# EAGLE schematic SchemaEletrica (EAGLE 9.6.2)
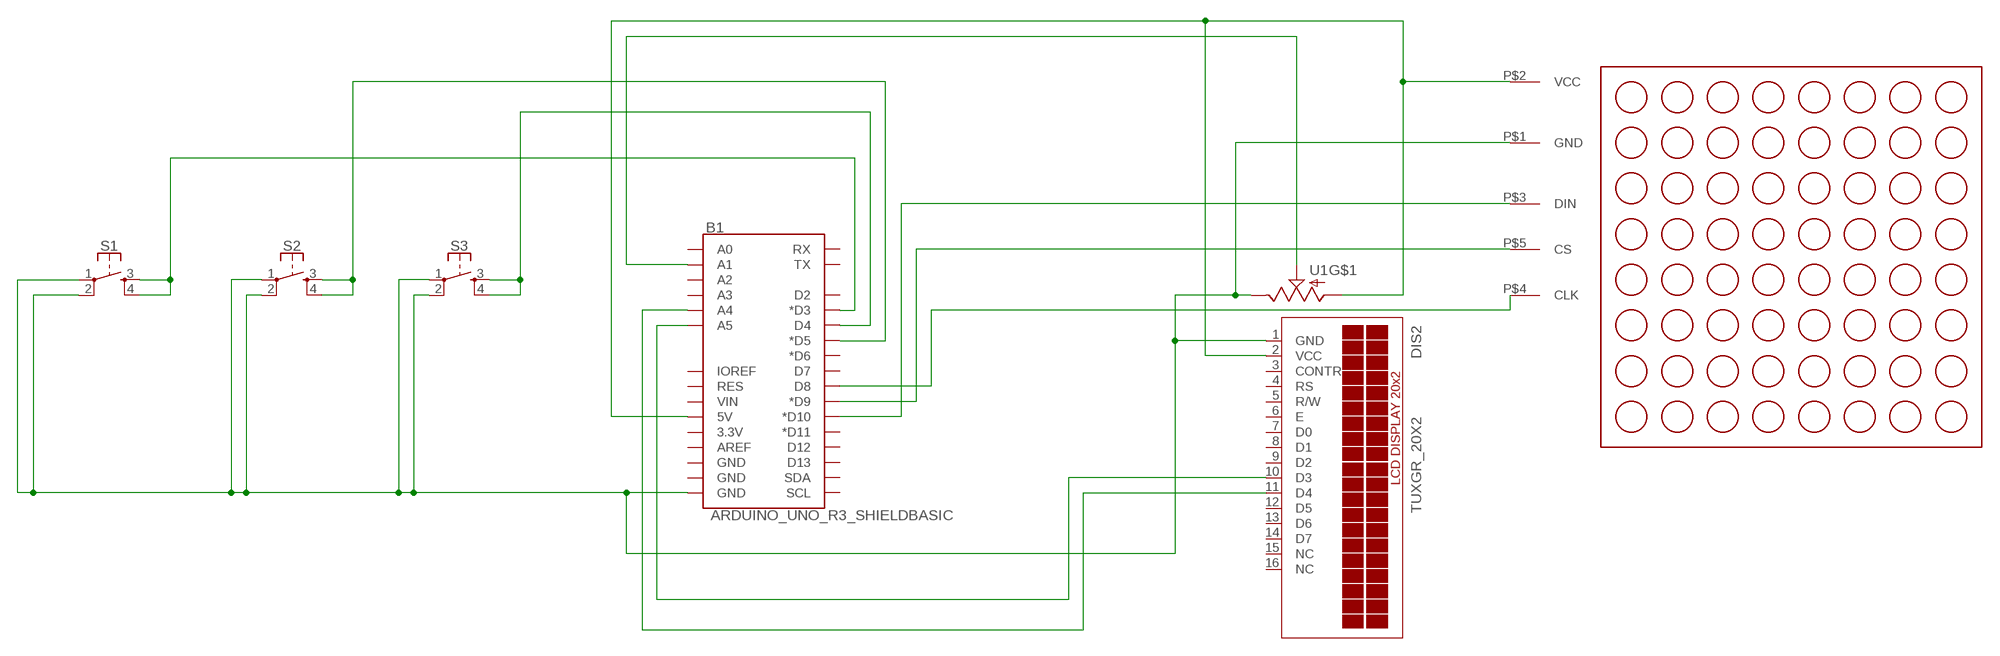
[diagram p0: schematic, sheet 1]

## Parts
B1  ARDUINO_UNO_R3_SHIELDBASIC  [UNO_R3_SHIELD]
DIS2  TUXGR_20X2  [TUXGR_20X2]
S1  SPARKFUN-SWITCHES_MOMENTARY-SWITCH-SPST-2-SMD-4.6X2.8MM  [SPARKFUN-SWITCHES_TACTILE_SWITCH_SMD_4.6X2.8MM]
S2  SPARKFUN-SWITCHES_MOMENTARY-SWITCH-SPST-2-SMD-4.6X2.8MM  [SPARKFUN-SWITCHES_TACTILE_SWITCH_SMD_4.6X2.8MM]
S3  SPARKFUN-SWITCHES_MOMENTARY-SWITCH-SPST-2-SMD-4.6X2.8MM  [SPARKFUN-SWITCHES_TACTILE_SWITCH_SMD_4.6X2.8MM]
U1  POT_SWITCHPOT_PTH  [POT_PTH]
U$1  RGB_MAT  [LED_MAT]

## Nets
N$1: B1.GND@0(GND) DIS2.1(GND) S1.1 S1.2 S2.1 S2.2 S3.1 S3.2 U1.E@2(E) U$1.P$1(GND)
N$2: B1.D3(*D3) S1.3 S1.4
N$3: B1.D4 S3.3 S3.4
N$4: B1.D5(*D5) S2.3 S2.4
N$6: B1.5V DIS2.2(VCC) U1.E@1(A) U$1.P$2(VCC)
N$7: B1.A1 U1.WAND(S)
N$8: B1.A5 DIS2.10(D3)
N$9: B1.A4 DIS2.11(D4)
N$10: B1.D10(*D10) U$1.P$3(DIN)
N$11: B1.D9(*D9) U$1.P$5(CS)
N$12: B1.D8 U$1.P$4(CLK)
Unconnected: B1.3.3V B1.A0 B1.A2 B1.A3 B1.AREF B1.D2 B1.D6(*D6) B1.D7 B1.D11(*D11) B1.D12 B1.D13 B1.GND@1(GND) B1.GND@2(GND) B1.IOREF B1.RES B1.RX B1.SCL B1.SDA B1.TX B1.VIN DIS2.3(CONTR) DIS2.4(RS) DIS2.5(R/W) DIS2.6(E) DIS2.7(D0) DIS2.8(D1) DIS2.9(D2) DIS2.12(D5) DIS2.13(D6) DIS2.14(D7) DIS2.15(NC) DIS2.16(NC) U1.S1 U1.S2

## Library data of the parts
B1 = SparkFun-Boards:ARDUINO_UNO_R3_SHIELD: Arduino R3 Shield Footprint Shield form compatible with the Arduino Uno R3. SparkFun Products: MG2639 Cellular Shield <https://www.sparkfun.com/products/13120> MIDI Shield <https://www.sparkfun.com/products/12898> R3 Stackable Headers Kit <https://www.sparkfun.com/products/11417>
DIS2 = display-lcd:TUXGR_20X2: Tuxgraphics LCD display 20x2 characters reflective, without background light Source: tuxgr_20x2.pdf; OC_FARNELL: unknown; OC_NEWARK: unknown
S1-S3 = ESP32_WROVER:SPARKFUN-SWITCHES_MOMENTARY-SWITCH-SPST-2: Momentary Switch (Pushbutton) - SPST - Two Circuits Normally-open (NO) SPST momentary switches (buttons, pushbuttons). Schematic symbol includes two switch circuits. Variants SMD-4.6MMX2.8MM - 4.60mm x 2.80mm Tactile Momentary Button Switch - Used on SparkFun SAMD21 Mini Breakout <https://www.sparkfun.com/products/13664> SMD-5.2MM - Mini Pushbutton Switch - SMD <https://www.sparkfun.com/products/8720> - Used on Arduino Pro Mini <https://www.sparkfun.com/products/11114>; PROD_ID: SWCH-14139; SF_SKU: COM-08720
U1 = SparkFun-Retired:POT_SWITCH: Potentiometer w/ switch.
U$1 = PM:RGB_MAT